# EAGLE design transceiver (EAGLE 7.6.0)
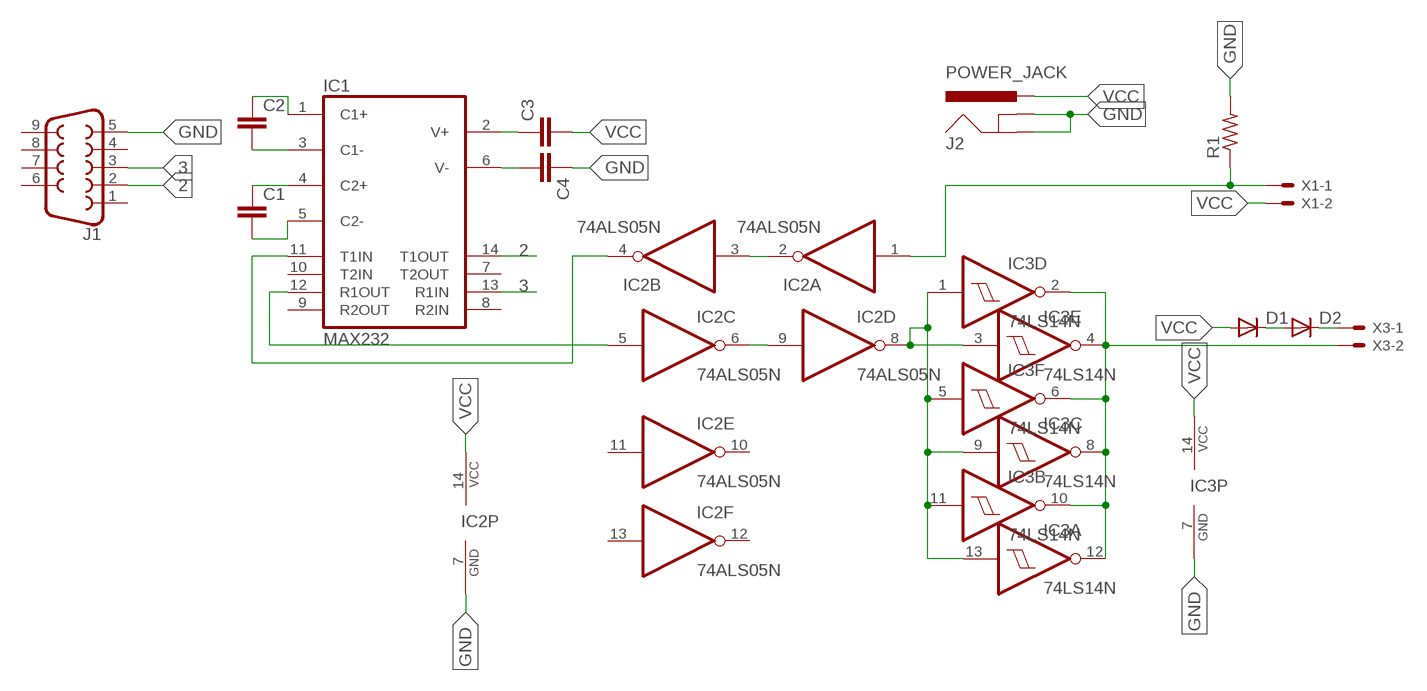
[diagram p0: schematic, sheet 1]

## Parts
C1  C2,5-3  [C2.5-3]
C2  C2,5-3  [C2.5-3]
C3  C2,5-3  [C2.5-3]
C4  C2,5-3  [C2.5-3]
D1  1N4004  [DO41-10]
D2  1N4004  [DO41-10]
IC1  MAX232  [DIL16]
IC2  74ALS05N  [DIL14]
IC3  74LS14N  [DIL14]
J1  DB9FEMALE  [DB9]
J2  POWER_JACK  [POWER_JACK_PTH]
R1  R-US_0207/12  [0207/12]
X1  JST-XH-02-PIN-LONG-PAD  [JST-XH-02-PACKAGE-LONG-PAD]
X3  JST-XH-02-PIN-LONG-PAD  [JST-XH-02-PACKAGE-LONG-PAD]

## Nets
2: IC1.14(T1OUT) J1.2
3: IC1.13(R1IN) J1.3
GND: C4.1 IC2.7(P:GND) IC3.7(P:GND) J1.5 J2.GND J2.GNDBREAK R1.2
N$1: IC1.11(T1IN) IC2.4(B:O)
N$2: IC1.12(R1OUT) IC2.5(C:I)
N$3: IC2.2(A:O) IC2.3(B:I)
N$4: IC2.6(C:O) IC2.9(D:I)
N$5: IC2.1(A:I) R1.1 X1.1
N$6: C4.2 IC1.6(V-)
N$7: IC2.8(D:O) IC3.1(D:I) IC3.3(E:I) IC3.5(F:I) IC3.9(C:I) IC3.11(B:I) IC3.13(A:I)
N$8: C1.1 IC1.4(C2+)
N$9: C2.2 IC1.3(C1-)
N$10: C1.2 IC1.5(C2-)
N$11: C2.1 IC1.1(C1+)
N$12: C3.1 IC1.2(V+)
N$13: D1.C D2.A
N$14: IC3.2(D:O) IC3.4(E:O) IC3.6(F:O) IC3.8(C:O) IC3.10(B:O) IC3.12(A:O) X3.2
N$15: D2.C X3.1
VCC: C3.2 D1.A IC2.14(P:VCC) IC3.14(P:VCC) J2.PWR X1.2
Unconnected: IC1.7(T2OUT) IC1.8(R2IN) IC1.9(R2OUT) IC1.10(T2IN) IC2.10(E:O) IC2.11(E:I) IC2.12(F:O) IC2.13(F:I) J1.1 J1.4 J1.6 J1.7 J1.8 J1.9

## Power pins joined to a net without a drawn wire
GND: IC1.15(GND)
VCC: IC1.16(VCC)

## Library data of the parts
C1-C4 = capacitor-wima:C: CAPACITOR naming: grid - package width
D1 D2 = diode-1:1N4004: DIODE general purpose rectifier, 1 A
IC1 = maxim:MAX232: RS232 TRANSCEIVER; MF: MAXIM; MPN: MAX232ACPE+; OC_FARNELL: 9723773; OC_NEWARK: 68K4544
IC2 = 74xx-us:74*05: Hex INVERTER, open collector
IC3 = 74xx-us:74*14: Hex schmitt trigger INVERTER
J1 = SparkFun-Connectors:DB9: DB9 Connector Standard DB9 (D-Sub 9) serial connector. Can be used for CAN bus as well as RS485 and RS232. Footprint production proven. Here is the female version connector we sell at SparkFun: 9 Pin Female Serial Connector - PCB Mount <https://www.sparkfun.com/products/429> (PRT-00429) This connector has been used on the following SparkFun products: SparkFun RS232 Shifter - SMD <https://www.sparkfun.com/products/449> (PRT-00449) SparkFun RS232 Shifter SMD (No DB9) <https://www.sparkfun.com/products/8780> (PRT-08780); PROD_ID: CONN-08194
J2 = SparkFun-Connectors:POWER_JACK: Power Jack Connector This is the standard 5.5mm barrel jack for power. The PTH is the most common, proven, reliable, footprint. The Slot footprint only works if the mill layer is transmitted to the PCB fab house so be warned. Here are the connectors we sell at SparkFun: DC Barrel Power Jack/Connector <https://www.sparkfun.com/products/119> (PRT-00119) DC Barrel Power Jack/Connector (SMD) <https://www.sparkfun.com/products/12748> (PRT-12748) DC Barrel Jack Adapter - Breadboard Compatible <https://www.sparkfun.com/products/10811> (PRT-10811) It is used on this SparkFun product (and many, many others): SparkFun RedBoard - Programmed with Arduino <https://www.sparkfun.com/products/12757> (DEV-12757) Also, if you need a mating power supply or connector, please check these out: Wall Adapter Power Supply - 9VDC 650mA <https://www.sparkfun.com/products/298> (TOL-00298) DC Barrel Jack Adapter - Male <https://www.sparkfun.com/products/10287> (PRT-10287); PROD_ID: CONN-08197
R1 = adafruit:R-US_: RESISTOR, American symbol
X1 X3 = Rembrandt Electronics - JST XH Connectors v1-0:JST-XH-02-PIN: JST XH Connector 2 Pin Wire to board connector. Pitch: 2,54 mm, (0.100") Number of pins: 2 Created by Rembrandt Electronics www.rembrandtelectronics.com

## Board
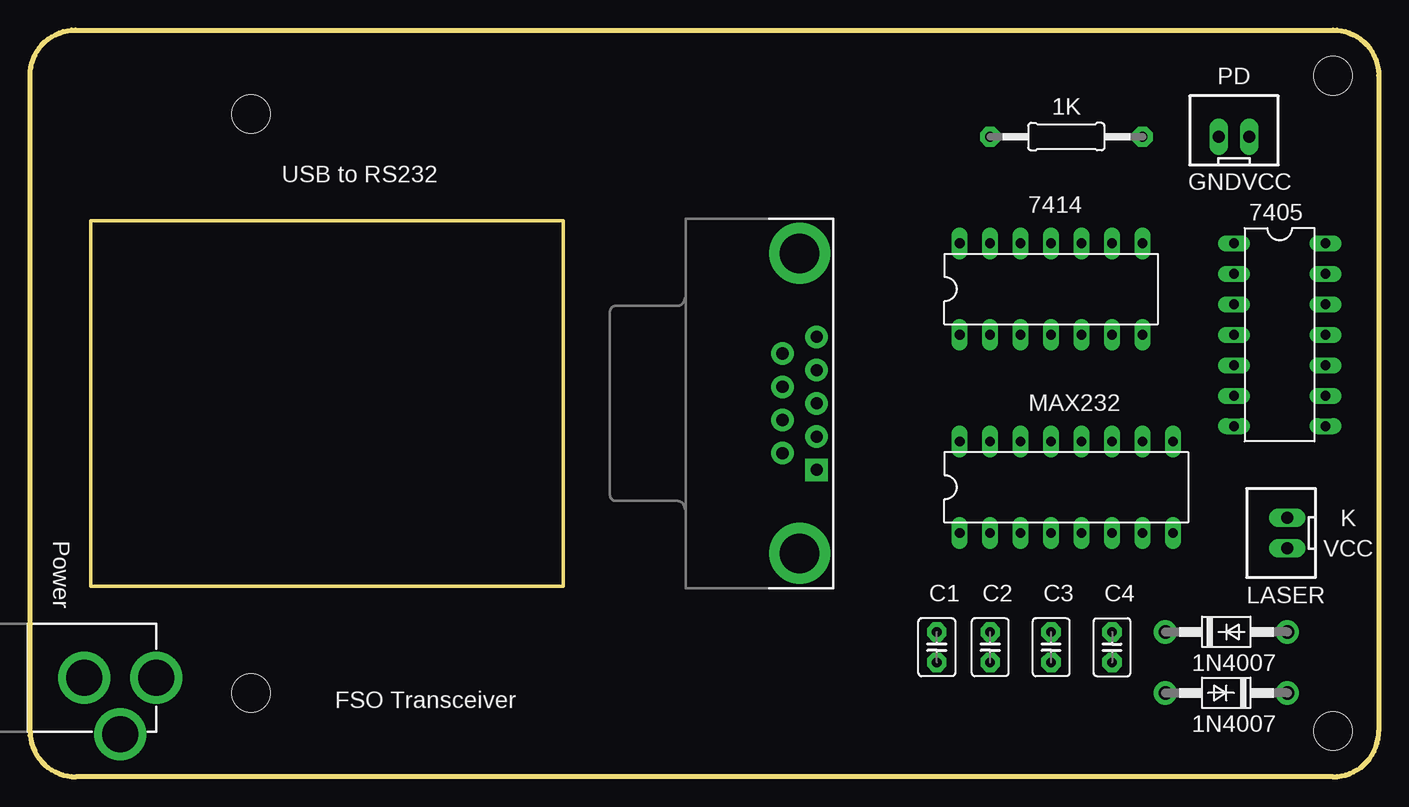
[diagram p1: board, top side]
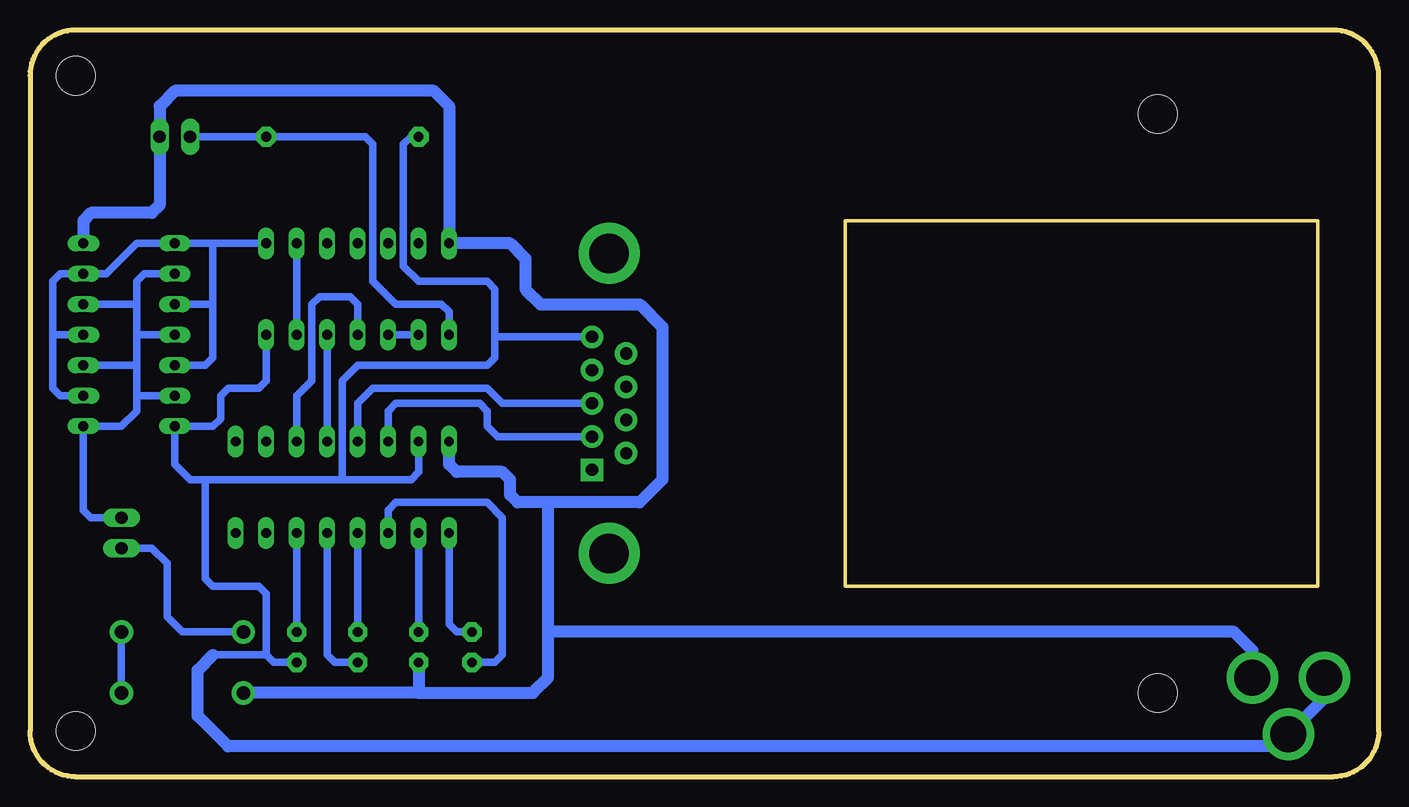
[diagram p2: board, bottom side, seen from below]

Size 112.4 x 62.23 mm. Coordinates in mm from the lower left corner, seen from the top.
Outline: 5.08,15.88 44.45,15.88 44.45,46.35 5.08,46.35 5.08,15.88
Outline: 3.81,62.23 108.59,62.23 arc-90 112.4,58.42 112.4,3.81 arc-90 108.59,0 3.81,0 arc-90 0,3.81 0,58.42 arc-90 3.81,62.23
Copper layers (1*16): Top 0.035mm / dielectric 1.5mm / Bottom 0.035mm
Design rules "default": minimum track width 6mil, minimum drill 0.35mm, track to track 6mil, track to pad 6mil, pad to pad 6mil, via to via 6mil, smd to smd 6mil, copper to edge 40mil, drill to drill 6mil, minimum pad ring 10mil, minimum via ring 8mil, stop-mask expansion 4mil, vias tented up to drill 0mil, thermal gap 10mil
Holes 3.2 mm at 108.59,58.42 108.59,3.81 18.41,6.99 18.41,55.24

### Footprints (pad centres in the part's own frame; a part is rotated, then mirrored left to right if it is on the bottom)
C2.5-3 = drill 0.813 pad 1.6 octagon: 1 -1.27,0; 2 1.27,0
DO41-10 = drill 1.118 pad 1.93: A 5.08,0; C -5.08,0
DIL16 = drill 0.813 long: 1 -8.89,-3.81; 2 -6.35,-3.81; 3 -3.81,-3.81; 4 -1.27,-3.81; 5 1.27,-3.81; 6 3.81,-3.81; 7 6.35,-3.81; 8 8.89,-3.81; 9 8.89,3.81; 10 6.35,3.81; 11 3.81,3.81; 12 1.27,3.81; 13 -1.27,3.81; 14 -3.81,3.81; 15 -6.35,3.81; 16 -8.89,3.81
DIL14 = drill 0.813 long: 1 -7.62,-3.81; 2 -5.08,-3.81; 3 -2.54,-3.81; 4 0,-3.81; 5 2.54,-3.81; 6 5.08,-3.81; 7 7.62,-3.81; 8 7.62,3.81; 9 5.08,3.81; 10 2.54,3.81; 11 0,3.81; 12 -2.54,3.81; 13 -5.08,3.81; 14 -7.62,3.81
DB9 = drill 1.016 pad 1.88 square: 1 -5.54,-1.42 | drill 1.016 pad 1.88: 2 -2.77,-1.42; 3 0,-1.42; 4 2.77,-1.42; 5 5.54,-1.42; 6 -4.15,1.42; 7 -1.38,1.42; 8 1.38,1.42; 9 4.15,1.42 | drill 3.302 pad 5.08: G1 -12.5,0; G2 12.5,0
POWER_JACK_PTH = drill 2.997 pad 4.318: GND 0,7.7; GNDBREAK 4.7,10.7; PWR 0,13.7
0207/12 = drill 0.813 pad 1.676 octagon: 1 -6.35,0; 2 6.35,0
JST-XH-02-PACKAGE-LONG-PAD = drill 1.016 long: 1 -1.27,0; 2 1.27,0

### Placement (x,y rotation side)
C1  85.09,10.79 270 top
C2  75.56,10.79 270 top
C3  80.01,10.79 270 top
C4  90.17,10.79 90 top
D1  99.69,6.99 180 top
D2  99.69,12.07 0 top
IC1  86.36,24.13 0 top
IC2  85.09,40.64 0 top
IC3  104.14,36.83 270 top
J1  64.14,31.12 90 top
J2  -3.17,8.26 270 top
R1  86.36,53.34 180 top
X1  100.33,53.34 0 top
X3  104.78,20.32 90 top

### Tracks (layer width: path | path; a pad name or v marks a point on that pad's centre or on a via)
2
  Bottom 0.61: IC1.14 82.55,30.48 81.92,31.12 74.93,31.12 74.3,30.48 74.3,29.21 73.43,28.35 J1.2
3
  Bottom 0.61: IC1.13 85.09,31.12 83.82,32.38 74.3,32.38 73.03,31.12 J1.3
GND
  Bottom 0.61: IC1.15 80.01,25.4 80.65,24.77 86.36,24.77 | 86.36,24.77 97.79,24.77 | 97.79,24.77 99.06,24.77 100.33,26.04 IC3.7 97.16,29.21 96.52,29.85 96.52,31.75 95.88,32.38 93.34,32.38 92.71,33.02 IC2.7 | J1.5 73.48,36.66 73.66,36.83 | 86.36,24.77 86.36,33.02 85.09,34.29 74.3,34.29 73.66,34.92 73.66,36.83 | 73.66,36.83 73.66,40.64 74.3,41.27 80.01,41.27 81.28,42.54 81.28,52.7 80.65,53.34 R1.2 | C4.1 92.08,9.53 92.71,10.16 | 97.16,10.16 92.71,10.16 | 92.71,10.16 92.71,15.24 93.34,15.88 97.16,15.88 97.79,16.51 97.79,24.77
  Bottom 1.016: 97.16,10.16 98.43,8.89 98.43,5.08 95.88,2.54 8.54,2.54 J2.GNDBREAK 4.52,6.55 J2.GND
N$1
  Bottom 0.61: IC1.11 90.17,31.75 88.9,33.02 88.9,39.37 88.27,40 85.72,40 85.09,39.37 IC2.4
N$2
  Bottom 0.61: IC2.5 IC1.12
N$3
  Bottom 0.61: IC2.2 IC2.3
N$4
  Bottom 0.61: IC2.6 IC2.9
N$5
  Bottom 0.61: X1.1 R1.1 84.45,53.34 83.82,52.7 83.82,41.27 81.92,39.37 78.11,39.37 77.47,38.73 IC2.1
N$6
  Bottom 0.61: C4.2 IC1.6
N$7
  Bottom 0.61: 110.49,36.83 110.49,41.27 109.86,41.91 IC3.13 106.05,41.91 103.5,44.45 IC3.1 97.16,44.45 | 110.49,36.83 110.49,32.38 109.86,31.75 IC3.9 | IC3.11 110.49,36.83 | IC3.5 97.79,34.29 97.16,34.92 97.16,39.37 | 97.16,39.37 97.16,44.45 | IC3.3 97.16,39.37 | IC2.8 97.16,44.45
N$8
  Bottom 0.61: IC1.4 C1.1
N$9
  Bottom 0.61: C2.2 73.66,9.53 73.03,10.16 73.03,21.59 74.3,22.86 81.92,22.86 82.55,22.23 IC1.3
N$10
  Bottom 0.61: IC1.5 87.63,10.16 87,9.53 C1.2
N$11
  Bottom 0.61: IC1.1 77.47,12.7 76.84,12.07 C2.1
N$12
  Bottom 0.61: C3.1 IC1.2
N$13
  Bottom 0.61: D1.C D2.A
N$14
  Bottom 0.61: IC3.2 102.87,41.91 103.5,41.27 103.5,39.37 | 103.5,39.37 IC3.12 | IC3.10 103.5,34.29 | 103.5,36.83 103.5,39.37 | IC3.4 103.5,36.83 | IC3.6 103.5,31.75 | 103.5,34.29 103.5,36.83 | 103.5,34.29 103.5,31.75 | 103.5,31.75 103.5,30.48 104.78,29.21 IC3.8 107.95,22.23 107.31,21.59 X3.2
N$15
  Bottom 0.61: D2.C 99.69,12.07 100.97,13.34 100.97,17.78 102.23,19.05 X3.1
VCC
  Bottom 1.016: C3.2 80.01,6.99 | 80.01,6.99 D1.A | 69.22,22.86 61.59,22.86 59.69,24.77 59.69,37.46 61.59,39.37 69.85,39.37 71.12,40.64 71.12,43.18 72.39,44.45 IC2.14 77.47,55.88 78.74,57.15 100.33,57.15 101.6,55.88 X1.2 101.6,47.62 102.23,46.99 107.31,46.99 107.95,46.35 IC3.14 | 80.01,6.99 70.48,6.99 69.22,8.26 69.22,12.07 | 69.22,12.07 69.22,22.86 | 69.22,22.86 71.75,22.86 72.39,23.5 72.39,24.77 73.03,25.4 76.84,25.4 77.47,26.04 IC1.16 | J2.PWR 10.52,10.53 12.07,12.07 69.22,12.07

### Text on the board
tPlace: PD | 1K | USB to RS232 | GND | VCC | 7414 | 7405 | MAX232 | K | Power | VCC | LASER | C1 | C2 | C3 | C4 | 1N4007 | FSO Transceiver | 1N4007